# EAGLE schematic BMS_MCU (EAGLE 7.5.0)
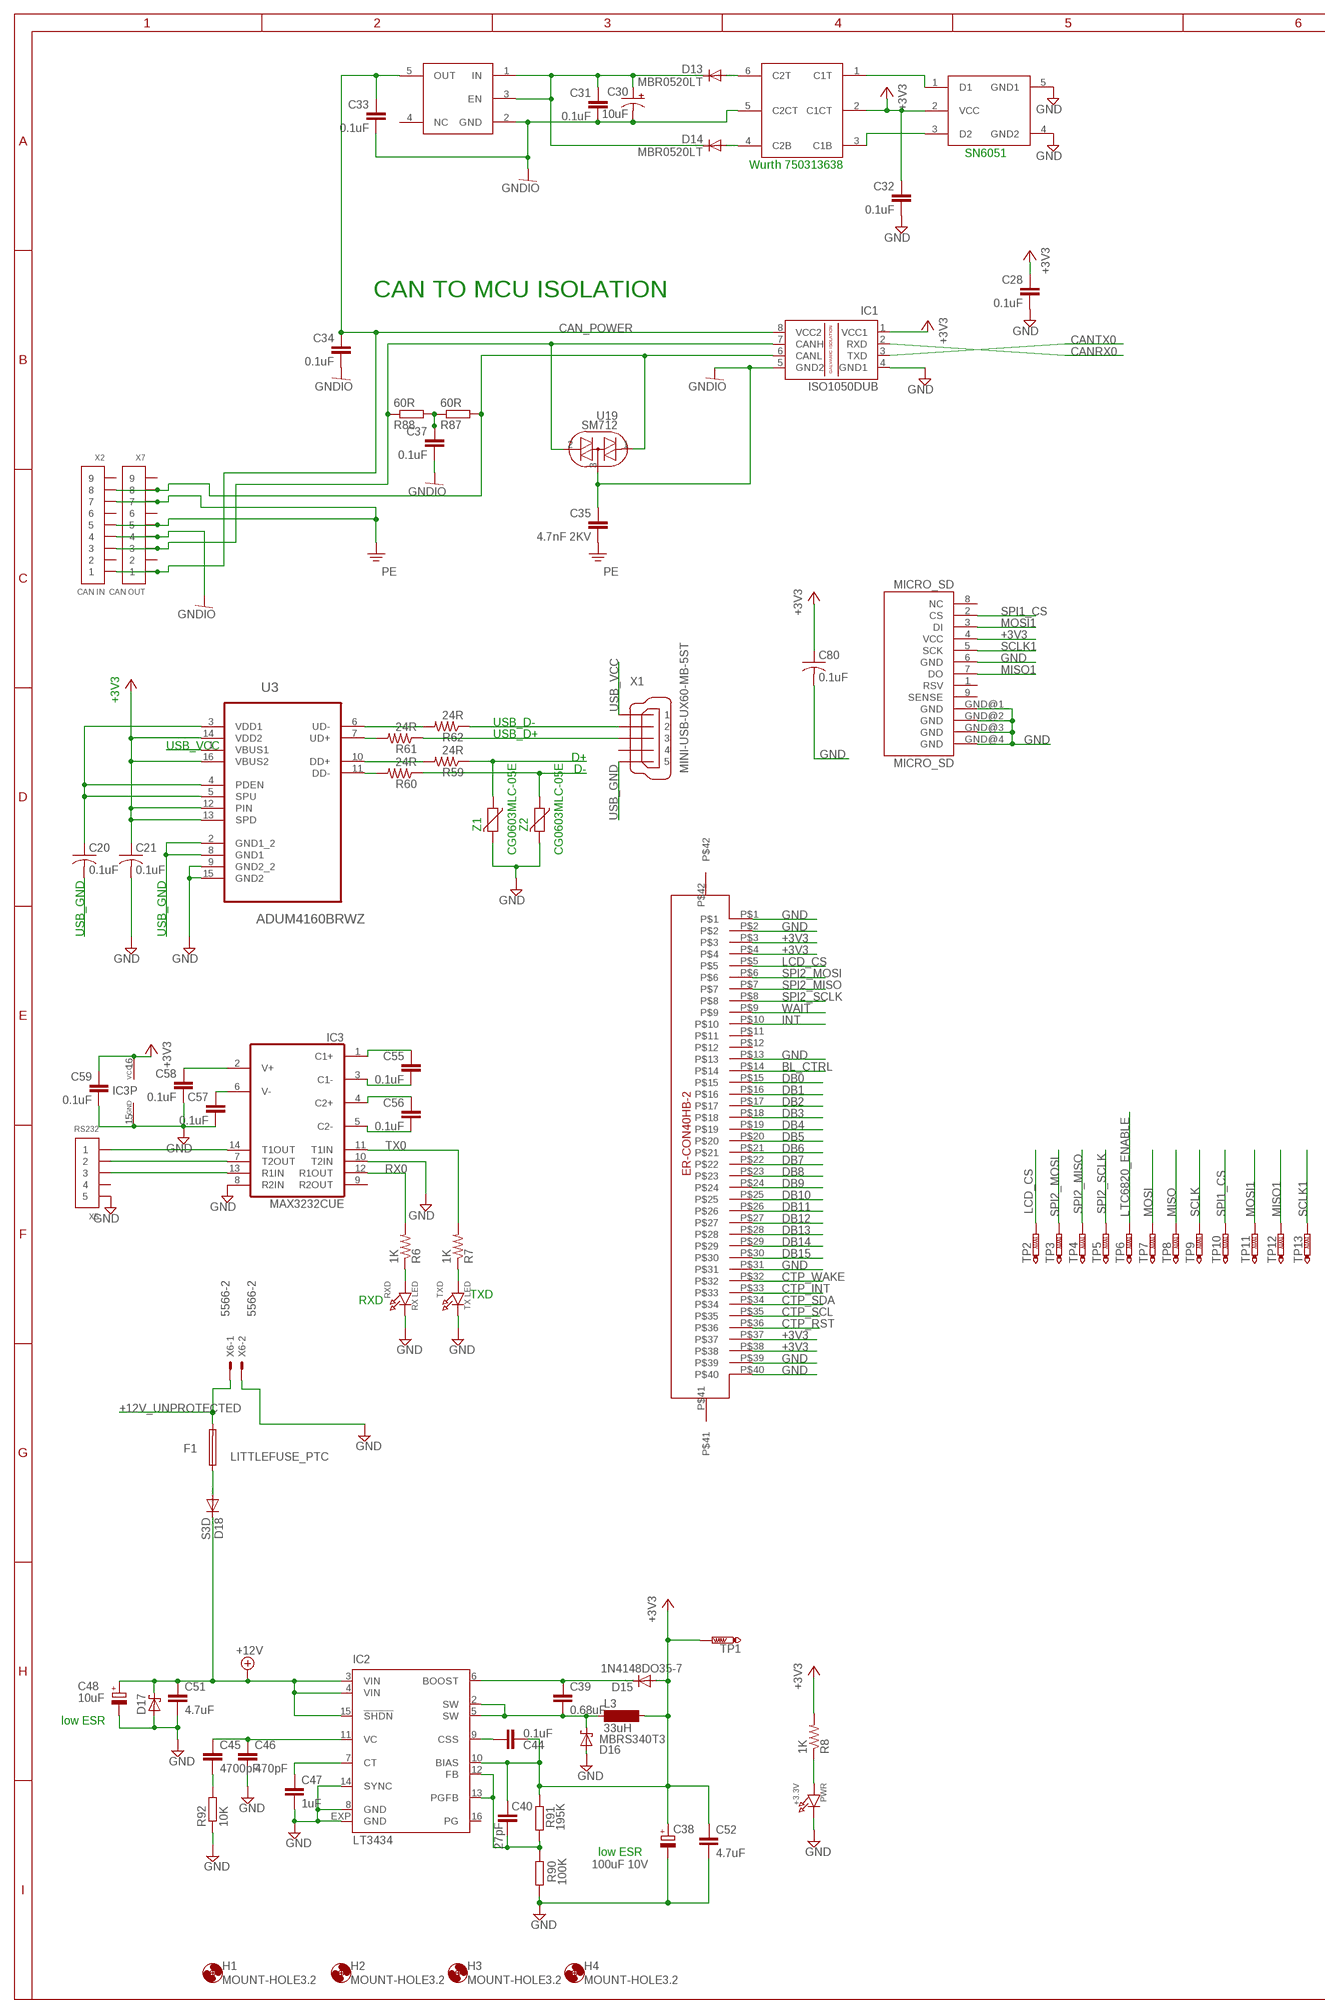
[diagram p0: schematic, sheet 1, part 1 of 2]
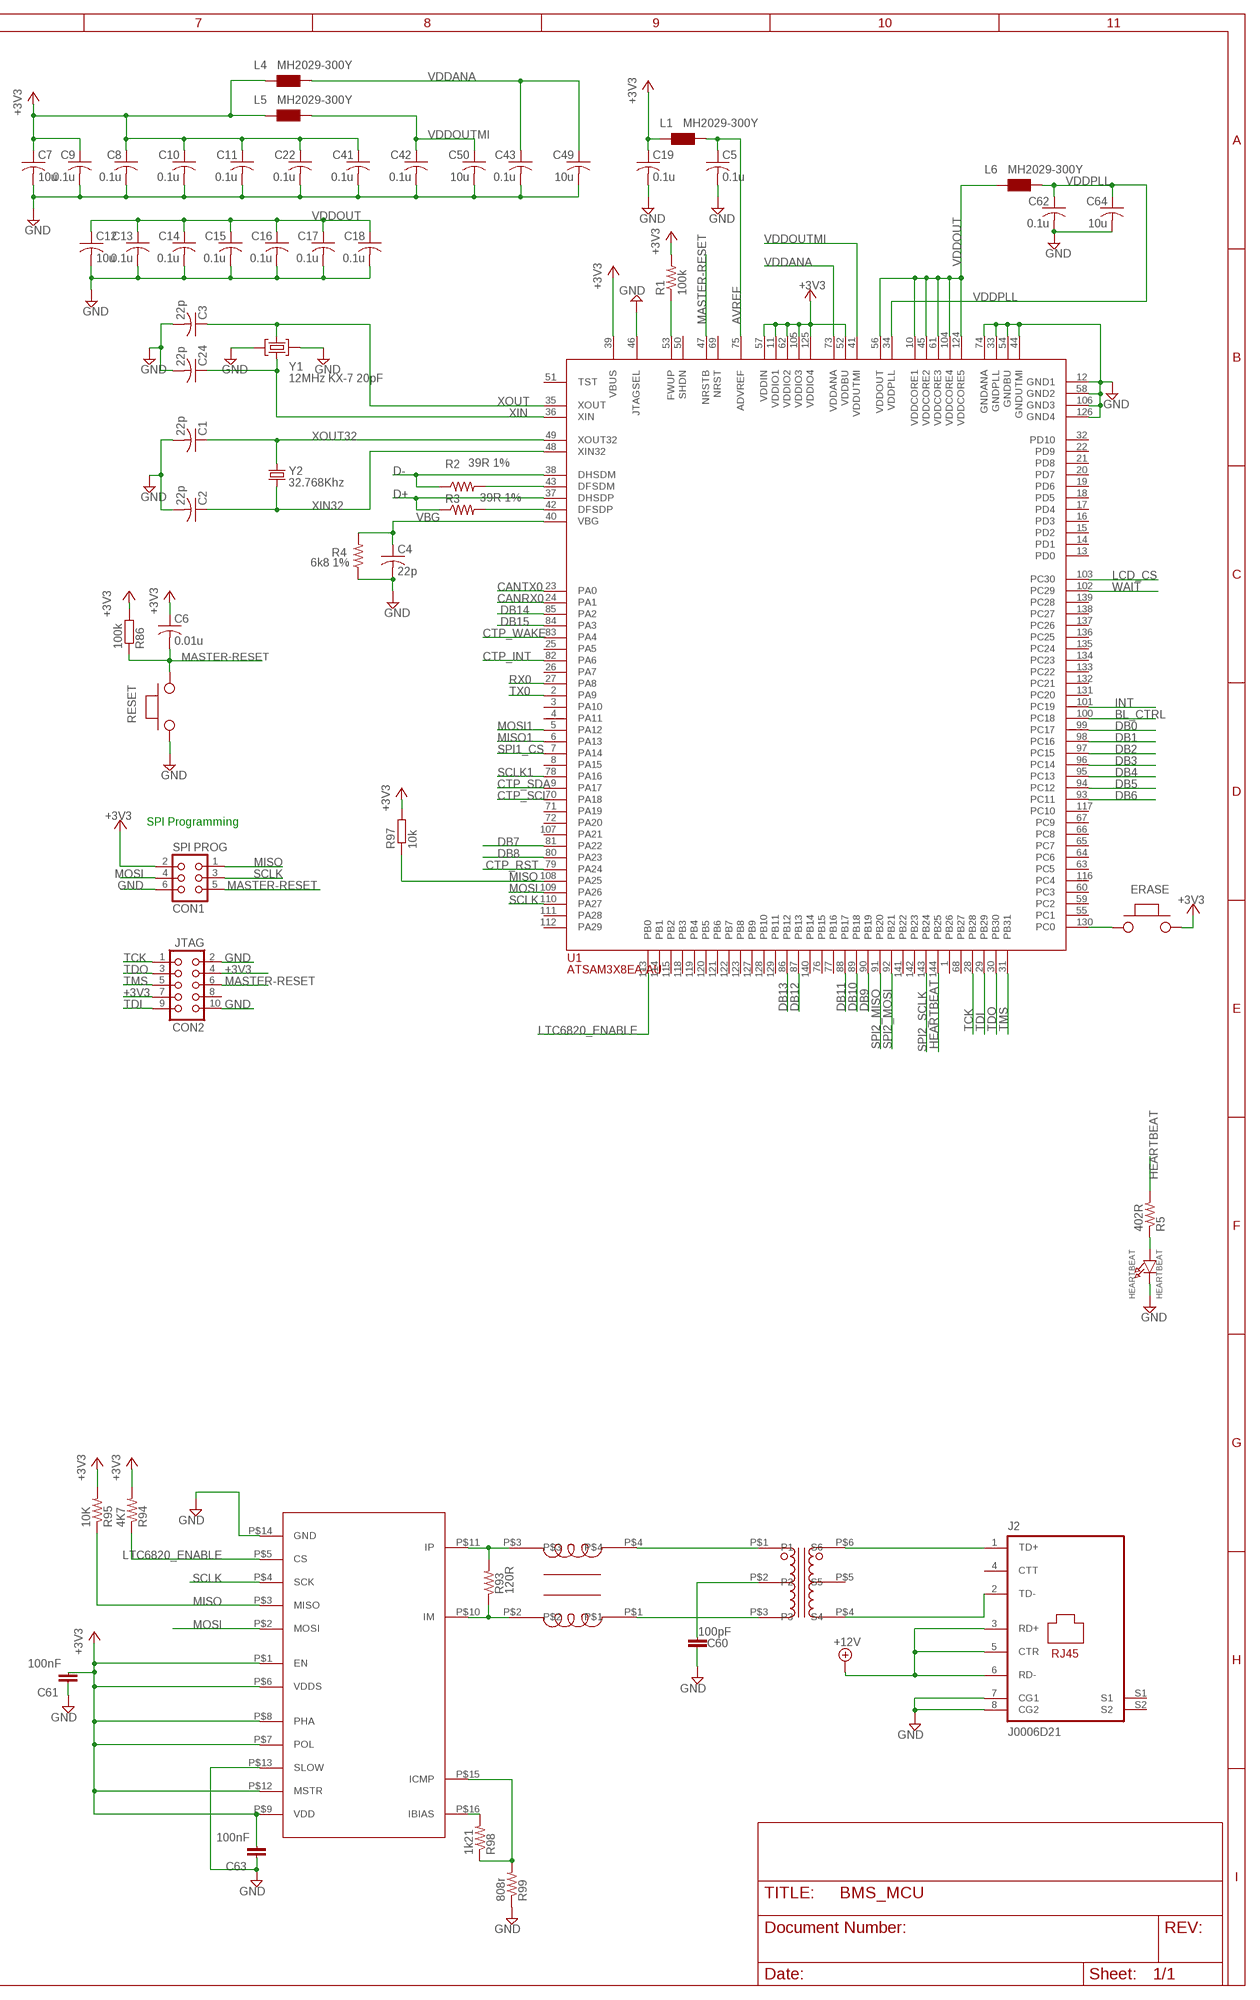
[diagram p1: schematic, sheet 1, part 2 of 2]

## Parts
+3.3V  PWR  LED0805  [CHIPLED_0805]
C1  22p  C-USC0805  [C0805]
C2  22p  C-USC0805  [C0805]
C3  22p  C-USC1206  [C1206]
C4  22p  C-USC0805  [C0805]
C5  0.1u  C-USC0805  [C0805]
C6  0.01u  C-USC0805  [C0805]
C7  10u  C-USC0805  [C0805]
C8  0.1u  C-USC0805  [C0805]
C9  0.1u  C-USC0805  [C0805]
C10  0.1u  C-USC0805  [C0805]
C11  0.1u  C-USC0805  [C0805]
C12  10u  C-USC0805  [C0805]
C13  0.1u  C-USC0805  [C0805]
C14  0.1u  C-USC0805  [C0805]
C15  0.1u  C-USC0805  [C0805]
C16  0.1u  C-USC0805  [C0805]
C17  0.1u  C-USC0805  [C0805]
C18  0.1u  C-USC0805  [C0805]
C19  0.1u  C-USC0805  [C0805]
C20  0.1uF  C-USC0805  [C0805]
C21  0.1uF  C-USC0805  [C0805]
C22  0.1u  C-USC0805  [C0805]
C24  22p  C-USC1206  [C1206]
C28  0.1uF  C-EUC0805  [C0805]
C30  10uF  CPOL-USSMCD  [SMC_D]
C31  0.1uF  C-EUC0603  [C0603]
C32  0.1uF  C-EUC1206  [C1206]
C33  0.1uF  C-EUC1206  [C1206]
C34  0.1uF  C-EUC0603  [C0603]
C35  4.7nF 2KV  C-EUC1206  [C1206]
C37  0.1uF  C-EUC1206  [C1206]
C38  100uF 10V  CPOL-EUSMCD  [SMC_D]
C39  0.68uF  C-EUC0603  [C0603]
C40  27pF  C-EUC0603  [C0603]
C41  0.1u  C-USC0805  [C0805]
C42  0.1u  C-USC0805  [C0805]
C43  0.1u  C-USC0805  [C0805]
C44  0.1uF  C-EUC0603  [C0603]
C45  4700pF  C-EUC0603  [C0603]
C46  470pF  C-EUC0603  [C0603]
C47  1uF  C-EUC0603  [C0603]
C48  10uF  CPOL-EUSMCD  [SMC_D]
C49  10u  C-USC0805  [C0805]
C50  10u  C-USC0805  [C0805]
C51  4.7uF  C-EUC1206  [C1206]
C52  4.7uF  C-EUC1206  [C1206]
C55  0.1uF  C-EUC0603  [C0603]
C56  0.1uF  C-EUC0603  [C0603]
C57  0.1uF  C-EUC0603  [C0603]
C58  0.1uF  C-EUC0603  [C0603]
C59  0.1uF  C-EUC0603  [C0603]
C60  100pF  C-EU-SMALL  [C1206@1]
C61  100nF  C-EU-SMALL_0603  [C0603@1]
C62  0.1u  C-USC0805  [C0805]
C63  100nF  C-EU-SMALL_0603  [C0603@1]
C64  10u  C-USC0805  [C0805]
C80  0.1uF  C-USC0805  [C0805]
CON1  SPI PROG  CON06  [CON06]
CON2  JTAG  CON10  [CON10]
D13  MBR0520LT  [SOD123]
D14  MBR0520LT  [SOD123]
D15  1N4148DO35-7  [DO35-7]
D16  MBRS340T3  [SMC]
D17  SCHOTTKY-DIODESMC  [SMC]
D18  S3D  DIODE-SMC  [SMC]
ERASE  PUCHBUTTON  [PUCHBUTTON]
F1  LITTLEFUSE_PTC  [1812]
H1  MOUNT-HOLE3.2  [3,2]
H2  MOUNT-HOLE3.2  [3,2]
H3  MOUNT-HOLE3.2  [3,2]
H4  MOUNT-HOLE3.2  [3,2]
HEARTBEAT  HEARTBEAT  LED0805  [CHIPLED_0805]
IC1  ISO1050DUB  [DUB-R-PDSO-G8]
IC2  LT3434  [TSSOP16EXP]
IC3  MAX3232CUE  [TSSOP16]
J2  J0006D21  [J0-C/D/E]
L1  MH2029-300Y  WE-CBF_0805  [0805]
L3  33uH  MS85  [MS85]
L4  MH2029-300Y  WE-CBF_0805  [0805]
L5  MH2029-300Y  WE-CBF_0805  [0805]
L6  MH2029-300Y  WE-CBF_0805  [0805]
MICRO_SD  MICRO_SD  MICROSD_PP  [MICROSD_PP]
R1  100k  R-US_R0805  [R0805]
R2  39R 1%  R-US_R0805  [R0805]
R3  39R 1%  R-US_R0805  [R0805]
R4  6k8 1%  R-US_R0805  [R0805]
R5  402R  R-US_R0805  [R0805]
R6  1K  R-US_R0805  [R0805]
R7  1K  R-US_R0805  [R0805]
R8  1K  R-US_R0805  [R0805]
R59  24R  R-US_R0805  [R0805]
R60  24R  R-US_R0805  [R0805]
R61  24R  R-US_R0805  [R0805]
R62  24R  R-US_R0805  [R0805]
R86  100k  R-EU_R0603  [R0603]
R87  60R  R-EU_R0603  [R0603]
R88  60R  R-EU_R0603  [R0603]
R90  100K  R-EU_R0603  [R0603]
R91  195K  R-EU_R0603  [R0603]
R92  10K  R-EU_R0603  [R0603]
R93  120R  R-US_R0603  [R0603]
R94  4K7  R-US_R0603  [R0603]
R95  10K  R-US_R0603  [R0603]
R97  10k  R-EU_R0603  [R0603]
R98  1k21  R-US_R0603  [R0603]
R99  808r  R-US_R0603  [R0603]
RESET  PUCHBUTTON  [PUCHBUTTON]
RXD  RX LED  LED0805  [CHIPLED_0805]
TP1  PTR1PAD1-13  [P1-13]
TP2  PTR1PAD1-13  [P1-13]
TP3  PTR1PAD1-13  [P1-13]
TP4  PTR1PAD1-13  [P1-13]
TP5  PTR1PAD1-13  [P1-13]
TP6  PTR1PAD1-13  [P1-13]
TP7  PTR1PAD1-13  [P1-13]
TP8  PTR1PAD1-13  [P1-13]
TP9  PTR1PAD1-13  [P1-13]
TP10  PTR1PAD1-13  [P1-13]
TP11  PTR1PAD1-13  [P1-13]
TP12  PTR1PAD1-13  [P1-13]
TP13  PTR1PAD1-13  [P1-13]
TXD  TX LED  LED0805  [CHIPLED_0805]
U1  ATSAM3X8EA-AU  ATSAM3X/AAU  [LQFP144]
U2  LTC6820  [MSOP16]
U3  ADUM4160BRWZ  [SOIC127P1032X265-16N]
U16  SN6501  [SOT23-DBV]
U17  WURTHWURTH  [TSOT23-6_DDC]
U18  TPS76350  [SOT23-DBV]
U19  SM712  [SOT23]
U$1  DLW43SH510XK2  [DLW43S]
U$2  ER-CON40HB-2  [ER-CON40HB-2]
U$4  T3001NL  [T3001NL]
X1  MINI-USB-UX60-MB-5ST  [UX60-MB-5ST]
X2  CAN IN  CONN_9-1-53398  [PB-53398-09]
X5  RS232  CONN_5-1-502386  [CM-502386-05]
X6  5566-2  [5566-2]
X7  CAN OUT  CONN_9-1-53398  [PB-53398-09]
Y1  12MHz KX-7 20pF  CRYSTAL-3.2-2.5  [CRYSTAL-3.2-2.5]
Y2  32.768Khz  ARDUINO_WIFI_SHIELD_V018_TG_RESONATOR_EPSON_FC_145  [ARDUINO_WIFI_SHIELD_V018_TG_RESONATOR_EPSON_FC_145]
Z1  CG0603MLC-05E  VARISTORCN0603  [CT/CN0603]
Z2  CG0603MLC-05E  VARISTORCN0603  [CT/CN0603]

## Nets
+3V3: C6.1 C7.1 C8.1 C9.1 C10.1 C11.1 C19.1 C21.1 C22.1 C28.1 C32.1 C38.+ C40.1 C41.1 C44.2 C52.1 C59.1 C61.1 C63.1 C80.1 CON1.2 CON2.7 D15.A ERASE.P$2 IC1.1(VCC1) IC2.10(BIAS) IC3.16(VCC) L1.1 L3.2 L4.1 L5.1 MICRO_SD.4(VCC) R1.2 R8.2 R86.2 R91.1 R94.2 R95.2 R97.2 TP1.TP U1.11(VDDIO1) U1.39(VBUS) U1.52(VDDBU) U1.57(VDDIN) U1.62(VDDIO2) U1.105(VDDIO3) U1.125(VDDIO4) U2.P$1(EN) U2.P$6(VDDS) U2.P$7(POL) U2.P$8(PHA) U2.P$9(VDD) U2.P$12(MSTR) U3.12(PIN) U3.13(SPD) U3.14(VDD2) U3.16(VBUS2) U16.2(VCC) U17.2(C1CT) U$2.P$3 U$2.P$4 U$2.P$37 U$2.P$38
+12V [POWER_12V]: C48.+ C51.1 D17.C D18.C IC2.3(VIN) IC2.4(VIN) IC2.15(!SHDN) J2.3(RD+) J2.5(CTR) J2.6(RD-)
+12V_UNPROTECTED [POWER_12V]: F1.P$2 X6.1
AVREF: C5.1 L1.2 U1.75(ADVREF)
BL_CTRL: U1.100(PC18) U$2.P$14
CAN_POWER: C33.1 C34.1 IC1.8(VCC2) U18.5(OUT) X2.1 X7.1
CANRX0: IC1.2(RXD) U1.24(PA1)
CANTX0: IC1.3(TXD) U1.23(PA0)
CTP_INT: U1.82(PA6) U$2.P$33
CTP_RST: U1.79(PA24) U$2.P$36
CTP_SCL: U1.70(PA18) U$2.P$35
CTP_SDA: U1.9(PA17) U$2.P$34
CTP_WAKE: U1.83(PA4) U$2.P$32
D+ [POWER_12V]: R3.1 R59.1 U1.37(DHSDP) Z1.1
D- [POWER_12V]: R2.1 R60.1 U1.38(DHSDM) Z2.1
DB0: U1.99(PC17) U$2.P$15
DB1: U1.98(PC16) U$2.P$16
DB2: U1.97(PC15) U$2.P$17
DB3: U1.96(PC14) U$2.P$18
DB4: U1.95(PC13) U$2.P$19
DB5: U1.94(PC12) U$2.P$20
DB6: U1.93(PC11) U$2.P$21
DB7: U1.81(PA22) U$2.P$22
DB8: U1.80(PA23) U$2.P$23
DB9: U1.90(PB19) U$2.P$24
DB10: U1.89(PB18) U$2.P$25
DB11: U1.88(PB17) U$2.P$26
DB12: U1.87(PB13) U$2.P$27
DB13: U1.86(PB12) U$2.P$28
DB14: U1.85(PA2) U$2.P$29
DB15: U1.84(PA3) U$2.P$30
ERASE_S: ERASE.P$1 U1.130(PC0)
GND [Ground]: +3.3V.C C1.2 C2.2 C3.2 C4.2 C5.2 C7.2 C8.2 C9.2 C10.2 C11.2 C12.2 C13.2 C14.2 C15.2 C16.2 C17.2 C18.2 C19.2 C21.2 C22.2 C24.2 C28.2 C32.2 C38.- C41.2 C42.2 C43.2 C46.2 C47.2 C48.- C49.2 C50.2 C51.2 C52.2 C57.2 C58.2 C59.2 C60.2 C61.2 C62.2 C63.2 C64.2 C80.2 CON1.6 CON2.2 CON2.10 D16.A D17.A HEARTBEAT.C IC1.4(GND1) IC2.8(GND) IC2.14(SYNC) IC2.EXP(GND) IC3.8(R2IN) IC3.10(T2IN) IC3.15(GND) J2.7(CG1) J2.8(CG2) MICRO_SD.6(GND) MICRO_SD.GND@1(GND) MICRO_SD.GND@2(GND) MICRO_SD.GND@3(GND) MICRO_SD.GND@4(GND) R4.1 R90.1 R92.1 R99.1 RESET.P$1 RXD.C TXD.C U1.12(GND1) U1.33(GNDPLL) U1.44(GNDUTMI) U1.46(JTAGSEL) U1.54(GNDBU) U1.58(GND2) U1.74(GNDANA) U1.106(GND3) U1.126(GND4) U2.P$13(SLOW) U2.P$14(GND) U3.9(GND2_2) U3.15(GND2) U16.4(GND2) U16.5(GND1) U$2.P$1 U$2.P$2 U$2.P$13 U$2.P$31 U$2.P$39 U$2.P$40 X5.5 X6.2 Y1.2(GND) Y1.4(GND) Z1.2 Z2.2
GNDIO [CAN_GND]: C30.- C31.2 C33.2 C34.2 C35.1 C37.2 IC1.5(GND2) U17.5(C2CT) U18.2(GND) U19.3(T2) X2.4 X7.4
HEARTBEAT: R5.2 U1.144(PB25)
INT: U1.101(PC19) U$2.P$10
LCD_CS: TP2.TP U1.103(PC30) U$2.P$5
LTC6820_ENABLE: R94.1 TP6.TP U1.113(PB0) U2.P$5(CS)
MASTER-RESET: C6.2 CON1.5 CON2.6 R86.1 RESET.P$2 U1.47(NRSTB)
MISO: CON1.1 R95.1 R97.1 TP8.TP U1.108(PA25) U2.P$3(MISO)
MISO1: MICRO_SD.7(DO) TP12.TP U1.6(PA13)
MOSI: CON1.4 TP7.TP U1.109(PA26) U2.P$2(MOSI)
MOSI1: MICRO_SD.3(DI) TP11.TP U1.5(PA12)
N$1: U$1.P$4 U$4.P$1(P1)
N$2: U$1.P$1 U$4.P$3(P3)
N$3: +3.3V.A R8.1
N$4: J2.2(TD-) U$4.P$4(S4)
N$5: J2.1(TD+) U$4.P$6(S6)
N$7: HEARTBEAT.A R5.1
N$8: C20.1 U3.3(VDD1) U3.4(PDEN) U3.5(SPU)
N$9: U16.1(D1) U17.1(C1T)
N$10: D13.A U17.6(C2T)
N$11: R62.2 U3.6(UD-)
N$12: R61.2 U3.7(UD+)
N$13: R6.1 RXD.A
N$14: R7.1 TXD.A
N$26: C30.+ C31.1 D13.C D14.C U18.1(IN) U18.3(EN)
N$29: D14.A U17.4(C2B)
N$42: R59.2 U3.10(DD+)
N$45: R60.2 U3.11(DD-)
N$47: R93.2 U2.P$11(IP) U$1.P$3
N$53: R2.2 U1.43(DFSDM)
N$54: IC1.6(CANL) R87.2 U19.1(T1) X2.8 X7.8
N$55: IC1.7(CANH) R88.1 U19.2(T3) X2.3 X7.3
N$56: R3.2 U1.42(DFSDP)
N$59: R1.1 U1.53(FWUP)
N$61: C40.2 IC2.12(FB) IC2.13(PGFB) R90.2 R91.2
N$62: C55.1 IC3.1(C1+)
N$63: C55.2 IC3.3(C1-)
N$73: C56.1 IC3.4(C2+)
N$108: R93.1 U2.P$10(IM) U$1.P$2
N$114: C60.1 U$4.P$2(P2)
N$115: C56.2 IC3.5(C2-)
N$118: U16.3(D2) U17.3(C1B)
N$128: C57.1 IC3.6(V-)
N$129: C37.1 R87.1 R88.2
N$130: C39.1 D15.C IC2.6(BOOST)
N$131: C44.1 IC2.9(CSS)
N$132 [POWER_5V]: C39.2 D16.C IC2.2(SW) IC2.5(SW) L3.1
N$133: C47.1 IC2.7(CT)
N$134: C45.1 C46.1 IC2.11(VC)
N$135: C45.2 R92.2
N$136 [POWER_12V]: D18.A F1.P$1
N$137: IC3.14(T1OUT) X5.1
N$138: IC3.7(T2OUT) X5.2
N$139: IC3.13(R1IN) X5.3
N$147: C58.1 IC3.2(V+)
N$150: R98.1 R99.2 U2.P$15(ICMP)
N$151: R98.2 U2.P$16(IBIAS)
PE: C35.2 X2.5 X2.7 X7.5 X7.7
RX0: IC3.12(R1OUT) R6.2 U1.27(PA8)
SCLK: CON1.3 TP9.TP U1.110(PA27) U2.P$4(SCK)
SCLK1: MICRO_SD.5(SCK) TP13.TP U1.78(PA16)
SPI1_CS: MICRO_SD.2(CS) TP10.TP U1.7(PA14)
SPI2_MISO: TP4.TP U1.91(PB20) U$2.P$7
SPI2_MOSI: TP3.TP U1.92(PB21) U$2.P$6
SPI2_SCLK: TP5.TP U1.143(PB24) U$2.P$8
TCK: CON2.1 U1.28(PB28)
TDI: CON2.9 U1.29(PB29)
TDO: CON2.3 U1.30(PB30)
TMS: CON2.5 U1.31(PB31)
TX0: IC3.11(T1IN) R7.2 U1.2(PA9)
USB_D+: R61.1 X1.3
USB_D-: R62.1 X1.2
USB_GND: C20.2 U3.2(GND1_2) U3.8(GND1) X1.5
USB_VCC: U3.1(VBUS1) X1.1
VBG: C4.1 R4.2 U1.40(VBG)
VDDANA: C43.1 C49.1 L4.2 U1.73(VDDANA)
VDDOUT: C12.1 C13.1 C14.1 C15.1 C16.1 C17.1 C18.1 L6.1 U1.10(VDDCORE1) U1.45(VDDCORE2) U1.56(VDDOUT) U1.61(VDDCORE3) U1.104(VDDCORE4) U1.124(VDDCORE5)
VDDOUTMI: C42.1 C50.1 L5.2 U1.41(VDDUTMI)
VDDPLL: C62.1 C64.1 L6.2 U1.34(VDDPLL)
WAIT: U1.102(PC29) U$2.P$9
XIN: C24.1 U1.36(XIN) Y1.1(C1)
XIN32: C2.1 U1.48(XIN32) Y2.P$2
XOUT: C3.1 U1.35(XOUT) Y1.3(C2)
XOUT32: C1.1 U1.49(XOUT32) Y2.P$1
Unconnected: CON2.4 CON2.8 IC2.16(PG) IC3.9(R2OUT) J2.4(CTT) J2.S1 J2.S2 MICRO_SD.1(RSV) MICRO_SD.8(NC) MICRO_SD.9(SENSE) U1.1(PB26) U1.3(PA10) U1.4(PA11) U1.8(PA15) U1.13(PD0) U1.14(PD1) U1.15(PD2) U1.16(PD3) U1.17(PD4) U1.18(PD5) U1.19(PD6) U1.20(PD7) U1.21(PD8) U1.22(PD9) U1.25(PA5) U1.26(PA7) U1.32(PD10) U1.50(SHDN) U1.51(TST) U1.55(PC1) U1.59(PC2) U1.60(PC3) U1.63(PC5) U1.64(PC6) U1.65(PC7) U1.66(PC8) U1.67(PC9) U1.68(PB27) U1.69(NRST) U1.71(PA19) U1.72(PA20) U1.76(PB15) U1.77(PB16) U1.107(PA21) U1.111(PA28) U1.112(PA29) U1.114(PB1) U1.115(PB2) U1.116(PC4) U1.117(PC10) U1.118(PB3) U1.119(PB4) U1.120(PB5) U1.121(PB6) U1.122(PB7) U1.123(PB8) U1.127(PB9) U1.128(PB10) U1.129(PB11) U1.131(PC20) U1.132(PC21) U1.133(PC22) U1.134(PC23) U1.135(PC24) U1.136(PC25) U1.137(PC26) U1.138(PC27) U1.139(PC28) U1.140(PB14) U1.141(PB22) U1.142(PB23) U18.4(NC) U$2.P$11 U$2.P$12 U$2.P$41 U$2.P$42 U$4.P$5(S5) X1.4 X2.2 X2.6 X2.9 X5.4 X7.2 X7.6 X7.9

## Notes on the sheet
- SN6051
- Wurth 750313638
- CAN TO MCU ISOLATION
- SPI Programming
- TXD
- RXD
- low ESR
- low ESR

## Library data of the parts
+3.3V HEARTBEAT RXD TXD = microbuilder:LED: LED 0603 - 0603 Surface Mount Package 2mA: Green LED - Low Power (3.9mcd, 2ma, 1.7Vf) - Digikey: 475-2709-2-ND Orange LED - Low Power (9.8mcd, 2ma, 1.8Vf) - Digikey: 475-1194-2-ND Red LED - Low Power (5mcd, 2ma, 1.8Vf) - Digikey: 475-1195-2-ND Yellow LED - Low Power (7mcd, 2ma, 1.8Vf) - Digikey: 475-1196-2-ND 5mA: Blue LED - Low Power (17mcd, 5ma, 2.9Vf) - Digikey: LNJ937W8CRACT-ND 0805 - 0805 Surface Mount Package 2mA: Red LED (8.8mcd, 2mA, 1.8Vf, Clear) - Low Power [Digikey: 475-2510-1-ND] Green LED (5mcd, 2mA, 1.8Vf, Clear) - Low Power [Digikey: 475-2730-1-ND] Yellow LED (11.3mcd, 2mA, 1.8Vf, Clear) - Low Power [Digikey: 475-2555-1-ND] 20mA: Red LED (104mcd, 20mA, Diffused) - LS R976 [Digikey: 475-1278-6-ND] Red LED (12mcd, 20mA, 2.0Vf, Clear) - APT2012EC [Digikey: 754-1128-1-ND] Green LED (15mcd, 20mA, 2.2Vf, Clear) - APT2012GC [Digikey: 754-1131-1-ND] Orange LED (160mcd, 20mA, 2.1Vf, Clear) - APT2012SECK [Digikey: 754-1130-1-ND] 1206 - 1206 Surface Mount Package Green LED (26mcd, 20mA, Diffused) - LG N971 [Digikey: 475-1407-6-ND] Red LED (15mcd, 20mA, Diffused) - LH N974 [Digikey: 475-1416-6-ND]
C1-C22 C24 C41-C43 C49 C50 C62 C64 C80 = rcl:C-US: CAPACITOR, American symbol
C28 C31-C35 C37 C39 C40 C44-C47 C51 C52 C55-C59 = rcl:C-EU: CAPACITOR, European symbol
C30 = rcl:CPOL-US: POLARIZED CAPACITOR, American symbol
C38 C48 = rcl:CPOL-EU: POLARIZED CAPACITOR, European symbol
C60 = rcl:C-EU-SMALL
C61 C63 = rcl:C-EU-SMALL_0603
CON1 = con-harting:CON06: CONNECTOR; OC_FARNELL: unknown; OC_NEWARK: unknown
CON2 = con-harting:CON10: CONNECTOR; OC_FARNELL: unknown; OC_NEWARK: unknown
D13 D14 = diode:MBR0520LT: SCHOTTKY BARRIER RECTIFIER Source: http://onsemi.com .. MBR0520LT1-D.pdf
D15 = diode:1N4148: DIODE high speed (Philips)
D16 = diode:MBRS3*0T3: SCHOTTKY BARRIER RECTIFIER 3.0 AMPERES 20, 30, 40 VOLT Source: MBRS340T3-D.pdf
D17 = diode:SCHOTTKY-DIODE: Schottky Diode
D18 = diode:DIODE-: DIODE
ERASE = PushButton:PUCHBUTTON; BUTTON: ERASE; ERASE: Erase
F1 = fuse:LITTLEFUSE_PTC
H1-H4 = holes:MOUNT-HOLE: MOUNTING HOLE with drill center marker
IC1 = texas:ISO1050: ISOLATED CAN TRANSCEIVER Source: http://focus.ti.com/lit/ds/symlink/iso1050.pdf; MPN: ISO1050DUBR; OC_FARNELL: 1755712; OC_NEWARK: 14R9899
IC2 = linear-technology:LT3434: High Voltage 3A, 200kHz Step-Down Switching Regulator with 100µA Quiescent Current Spurce: www.linear.com .. 3434fb.pdf; MPN: LT3434EFE#PBF; OC_FARNELL: 1501035; OC_NEWARK: 57M8118
IC3 = maxim:MAX3232*: True RS-232 Transceivers 3.0V to 5.5V, Low-Power up to 1Mbps, Using Four 0.1µF External Capacitors Source: http://pdfserv.maxim-ic.com/en/ds/MAX3222-MAX3241.pdf; MF: MAXIM; MPN: MAX3232CUE+; OC_FARNELL: 1593350; OC_NEWARK: 68K4629
J2 = pulse-eng:J0006D21: RJ45 PulseJack
L1 L4-L6 = wuerth-elektronik:WE-CBF: SMD EMI Suppression Ferrite Beads - excellent anti-EMI properties - low DCR - impedances till 3000 ohms - rated current up to 6 A
L3 = inductor-neosid:MS85: INDUCTOR SMD power inductor; OC_FARNELL: unknown; OC_NEWARK: unknown
MICRO_SD = DE1594-v2:MICROSD_PP
R1-R8 R59-R62 R93-R95 R98 R99 = rcl:R-US_: RESISTOR, American symbol
R86-R88 R90-R92 R97 = rcl:R-EU_: RESISTOR, European symbol
RESET = PushButton:PUCHBUTTON; BUTTON: RESET; RESET: RESET
TP1-TP13 = testpad:PTR1: TEST PIN
U1 = SmartPrj:ATSAM3X/A
U2 = linear-technology:LTC6820
U3 = analog-devices:ADUM4160BRWZ: Full/Low Speed 5 kV USB Digital Isolator; MPN: ADUM4160BRWZ; OC_FARNELL: 1858056; OC_NEWARK: 24R8652; PACKAGE: SOIC-16; SUPPLIER: Analog Devices
U16 = texas:SN6501
U17 = texas:WURTH
U18 = texas:TPS76350
U19 = diode:SM712
U$1 = murata-filter:DLW43SH510XK2
U$2 = EastRising:ER-CON40HB-2
U$4 = pulse-eng:T3001NL
X1 = con-hirose:MINI-USB-: MINI USB Connector Source: http://www.hirose.co.jp/cataloge_hp/e24000019.pdf; OC_FARNELL: unknown; OC_NEWARK: unknown
X2 X7 = molex_clik-mate:CONN_9-1
X5 = molex_clik-mate:CONN_5-1
X6 = con-molex:5566-2: Mini FIT connector 2 pol Source: http://www.molex.com; OC_FARNELL: 1822072; OC_NEWARK: unknown
Y1 = SmartPrj:CRYSTAL-3.2-2.5
Y2 = Arduino_Wifi_shield_v018_tG:ARDUINO_WIFI_SHIELD_V018_TG_RESONATOR_EPSON_FC_145
Z1 Z2 = varistor:VARISTOR: VARISTOR

## Net classes
0 default: drill 0.305 mm, clearance 0.152 mm
1 POWER_12V: width 0.254 mm, drill 0.305 mm, clearance 0.152 mm to class 0, clearance 0.152 mm
2 POWER_5V: width 0.254 mm, drill 0.305 mm, clearance 0.152 mm to class 0, clearance 0.152 mm to class 1, clearance 0.152 mm
3 Ground: width 0.254 mm, drill 0.305 mm, clearance 0.152 mm to class 0, clearance 0.152 mm to class 1, clearance 0.152 mm to class 2, clearance 0.152 mm
12 CAN_GND: clearance 0.381 mm to class 0, clearance 0.381 mm to class 1, clearance 0.381 mm to class 2, clearance 0.381 mm to class 3